# EAGLE schematic USER (EAGLE 9.3.0)
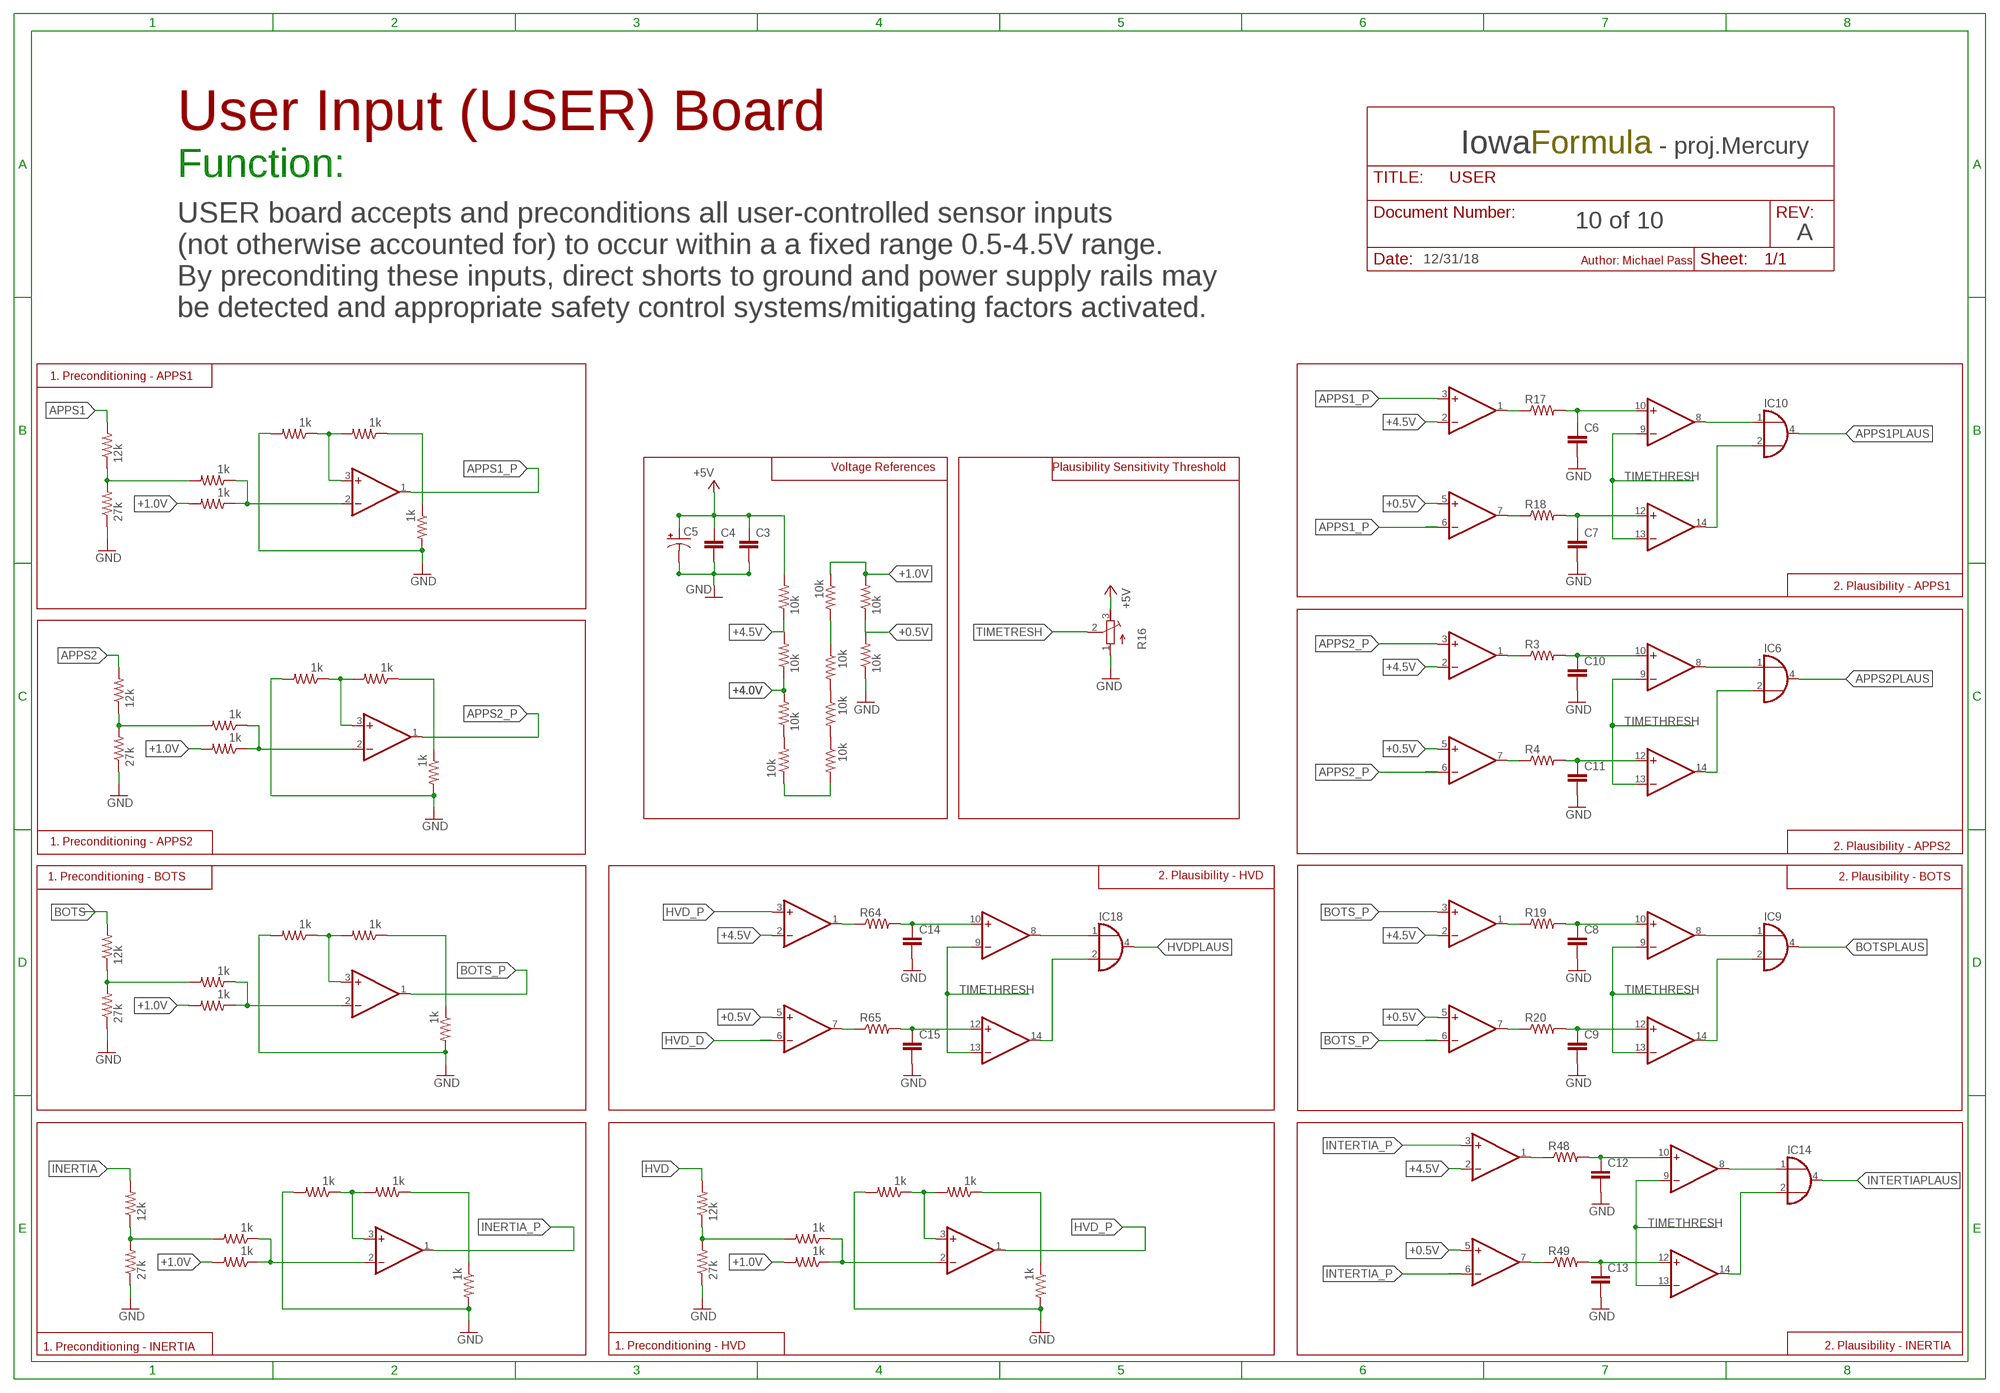
[diagram p0: schematic, sheet 1]

## Parts
C3  C-EUC0805  [C0805]
C4  C-EUC0805  [C0805]
C5  CPOL-US085CS-1AR  [085CS_1AR]
C6  C-EUC0805  [C0805]
C7  C-EUC0805  [C0805]
C8  C-EUC0805  [C0805]
C9  C-EUC0805  [C0805]
C10  C-EUC0805  [C0805]
C11  C-EUC0805  [C0805]
C12  C-EUC0805  [C0805]
C13  C-EUC0805  [C0805]
C14  C-EUC0805  [C0805]
C15  C-EUC0805  [C0805]
IC1  OP11D  [SO14]
IC3  OP11D  [SO14]
IC4  OP11D  [SO14]
IC5  OP11D  [SO14]
IC6  74AHC1G32DCK  [SC70-5]
IC7  OP11D  [SO14]
IC8  OP11D  [SO14]
IC9  74AHC1G32DCK  [SC70-5]
IC10  74AHC1G32DCK  [SC70-5]
IC13  OP11D  [SO14]
IC14  74AHC1G32DCK  [SC70-5]
IC17  OP11D  [SO14]
IC18  74AHC1G32DCK  [SC70-5]
IC19  OP11D  [SO14]
IC20  OP11D  [SO14]
R1  12k  R-US_R0805  [R0805]
R2  27k  R-US_R0805  [R0805]
R3  R-US_R0805  [R0805]
R4  R-US_R0805  [R0805]
R5  10k  R-US_R0805  [R0805]
R6  10k  R-US_R0805  [R0805]
R7  12k  R-US_R0805  [R0805]
R8  10k  R-US_R0805  [R0805]
R9  10k  R-US_R0805  [R0805]
R10  10k  R-US_R0805  [R0805]
R11  10k  R-US_R0805  [R0805]
R12  10k  R-US_R0805  [R0805]
R13  10k  R-US_R0805  [R0805]
R14  10k  R-US_R0805  [R0805]
R15  10k  R-US_R0805  [R0805]
R16  R-TRIMM3224X  [RTRIM3224X]
R17  R-US_R0805  [R0805]
R18  R-US_R0805  [R0805]
R19  R-US_R0805  [R0805]
R20  R-US_R0805  [R0805]
R21  27k  R-US_R0805  [R0805]
R22  1k  R-US_R0805  [R0805]
R23  1k  R-US_R0805  [R0805]
R24  1k  R-US_R0805  [R0805]
R25  1k  R-US_R0805  [R0805]
R26  1k  R-US_R0805  [R0805]
R48  R-US_R0805  [R0805]
R49  R-US_R0805  [R0805]
R64  R-US_R0805  [R0805]
R65  R-US_R0805  [R0805]
R66  1k  R-US_R0805  [R0805]
R67  1k  R-US_R0805  [R0805]
R68  1k  R-US_R0805  [R0805]
R69  1k  R-US_R0805  [R0805]
R70  1k  R-US_R0805  [R0805]
R71  12k  R-US_R0805  [R0805]
R72  27k  R-US_R0805  [R0805]
R73  1k  R-US_R0805  [R0805]
R74  1k  R-US_R0805  [R0805]
R75  1k  R-US_R0805  [R0805]
R76  1k  R-US_R0805  [R0805]
R77  1k  R-US_R0805  [R0805]
R78  12k  R-US_R0805  [R0805]
R79  27k  R-US_R0805  [R0805]
R80  1k  R-US_R0805  [R0805]
R81  1k  R-US_R0805  [R0805]
R82  1k  R-US_R0805  [R0805]
R83  1k  R-US_R0805  [R0805]
R84  1k  R-US_R0805  [R0805]
R85  12k  R-US_R0805  [R0805]
R86  27k  R-US_R0805  [R0805]
R87  1k  R-US_R0805  [R0805]
R88  1k  R-US_R0805  [R0805]
R89  1k  R-US_R0805  [R0805]
R90  1k  R-US_R0805  [R0805]
R91  1k  R-US_R0805  [R0805]

## Nets
+0.5V: IC1.5(B:+IN) IC4.5(B:+IN) IC5.5(B:+IN) IC13.5(B:+IN) IC17.5(B:+IN) R14.1 R15.2
+1.0V: R13.1 R14.2 R23.2 R67.2 R74.2 R81.2 R88.2
+4.0V: R6.1 R8.2
+4.5V: IC1.2(A:-IN) IC4.2(A:-IN) IC5.2(A:-IN) IC13.2(A:-IN) IC17.2(A:-IN) R5.1 R6.2
+5V: C3.1 C4.1 C5.+ R5.2 R16.3(E)
APPS1: R71.2
APPS1_P: IC5.3(A:+IN) IC5.6(B:-IN) IC7.1(A:OUT)
APPS1PLAUS: IC10.4(O)
APPS2: R78.2
APPS2_P: IC1.3(A:+IN) IC1.6(B:-IN) IC19.1(A:OUT)
APPS2PLAUS: IC6.4(O)
BOTS: R7.2
BOTS_P: IC4.3(A:+IN) IC4.6(B:-IN) IC8.1(A:OUT)
BOTSPLAUS: IC9.4(O)
GND: C3.2 C4.2 C5.- C6.2 C7.2 C8.2 C9.2 C10.2 C11.2 C12.2 C13.2 C14.2 C15.2 R2.1 R15.1 R16.1(A) R21.1 R24.2 R26.2 R68.2 R70.2 R72.1 R75.2 R77.2 R79.1 R82.2 R84.2 R86.1 R89.2 R91.2
HVD: R85.2
HVD_D: IC17.6(B:-IN)
HVD_P: IC17.3(A:+IN) IC20.1(A:OUT)
HVDPLAUS: IC18.4(O)
INERTIA: R1.2
INERTIA_P: IC3.1(A:OUT)
INTERTIA_P: IC13.3(A:+IN) IC13.6(B:-IN)
INTERTIAPLAUS: IC14.4(O)
N$1: IC3.3(A:+IN) R68.1 R69.2
N$2: R8.1 R9.2
N$3: IC4.1(A:OUT) R19.1
N$4: R9.1 R10.2
N$5: R11.1 R12.2
N$6: IC5.1(A:OUT) R17.1
N$7: R12.1 R13.2
N$8: R1.1 R2.2 R66.2
N$9: R10.1 R11.2
N$10: R69.1 R70.1
N$11: IC3.2(A:-IN) R66.1 R67.1
N$12: C6.1 IC5.10(C:+IN) R17.2
N$13: C7.1 IC5.12(D:+IN) R18.2
N$14: IC5.7(B:OUT) R18.1
N$15: IC1.1(A:OUT) R3.1
N$16: C10.1 IC1.10(C:+IN) R3.2
N$17: C11.1 IC1.12(D:+IN) R4.2
N$18: IC1.7(B:OUT) R4.1
N$20: C8.1 IC4.10(C:+IN) R19.2
N$23: C9.1 IC4.12(D:+IN) R20.2
N$24: IC4.7(B:OUT) R20.1
N$26: IC1.8(C:OUT) IC6.1(I0)
N$27: IC1.14(D:OUT) IC6.2(I1)
N$28: IC8.3(A:+IN) R24.1 R25.2
N$29: R7.1 R21.2 R22.2
N$30: R25.1 R26.1
N$31: IC8.2(A:-IN) R22.1 R23.1
N$34: IC4.8(C:OUT) IC9.1(I0)
N$35: IC4.14(D:OUT) IC9.2(I1)
N$42: IC13.1(A:OUT) R48.1
N$43: C12.1 IC13.10(C:+IN) R48.2
N$44: IC7.3(A:+IN) R75.1 R76.2
N$45: R71.1 R72.2 R73.2
N$46: IC5.8(C:OUT) IC10.1(I0)
N$47: IC5.14(D:OUT) IC10.2(I1)
N$48: C13.1 IC13.12(D:+IN) R49.2
N$49: IC13.7(B:OUT) R49.1
N$50: IC13.8(C:OUT) IC14.1(I0)
N$51: IC13.14(D:OUT) IC14.2(I1)
N$60: IC17.1(A:OUT) R64.1
N$61: C14.1 IC17.10(C:+IN) R64.2
N$62: C15.1 IC17.12(D:+IN) R65.2
N$63: IC17.7(B:OUT) R65.1
N$64: IC17.8(C:OUT) IC18.1(I0)
N$65: IC17.14(D:OUT) IC18.2(I1)
N$66: R76.1 R77.1
N$67: IC7.2(A:-IN) R73.1 R74.1
N$68: IC19.3(A:+IN) R82.1 R83.2
N$69: R78.1 R79.2 R80.2
N$70: R83.1 R84.1
N$71: IC19.2(A:-IN) R80.1 R81.1
N$72: IC20.3(A:+IN) R89.1 R90.2
N$73: R85.1 R86.2 R87.2
N$74: R90.1 R91.1
N$75: IC20.2(A:-IN) R87.1 R88.1
TIMETHRESH: IC1.9(C:-IN) IC1.13(D:-IN) IC4.9(C:-IN) IC4.13(D:-IN) IC5.9(C:-IN) IC5.13(D:-IN) IC13.9(C:-IN) IC13.13(D:-IN) IC17.9(C:-IN) IC17.13(D:-IN)
TIMETRESH: R16.2(S)
Unconnected: IC3.5(B:+IN) IC3.6(B:-IN) IC3.7(B:OUT) IC3.8(C:OUT) IC3.9(C:-IN) IC3.10(C:+IN) IC3.12(D:+IN) IC3.13(D:-IN) IC3.14(D:OUT) IC7.5(B:+IN) IC7.6(B:-IN) IC7.7(B:OUT) IC7.8(C:OUT) IC7.9(C:-IN) IC7.10(C:+IN) IC7.12(D:+IN) IC7.13(D:-IN) IC7.14(D:OUT) IC8.5(B:+IN) IC8.6(B:-IN) IC8.7(B:OUT) IC8.8(C:OUT) IC8.9(C:-IN) IC8.10(C:+IN) IC8.12(D:+IN) IC8.13(D:-IN) IC8.14(D:OUT) IC19.5(B:+IN) IC19.6(B:-IN) IC19.7(B:OUT) IC19.8(C:OUT) IC19.9(C:-IN) IC19.10(C:+IN) IC19.12(D:+IN) IC19.13(D:-IN) IC19.14(D:OUT) IC20.5(B:+IN) IC20.6(B:-IN) IC20.7(B:OUT) IC20.8(C:OUT) IC20.9(C:-IN) IC20.10(C:+IN) IC20.12(D:+IN) IC20.13(D:-IN) IC20.14(D:OUT)

## Notes on the sheet
- User Input (USER) Board
- Iowa | Formula | - proj.Mercury
- Function:
- 10 of 10
- A
- 12/31/18 | Author: Michael Pass
- USER board accepts and preconditions all user-controlled sensor inputs
  (not otherwise accounted for) to occur within a a fixed range 0.5-4.5V range.
  By preconditing these inputs, direct shorts to ground and power supply rails may
  be detected and appropriate safety control systems/mitigating factors activated.
- 1. Preconditioning - APPS1
- Voltage References | Plausibility Sensitivity Threshold
- 2. Plausibility - APPS1
- 1. Preconditioning - APPS2
- 2. Plausibility - APPS2
- 1. Preconditioning - BOTS | 2. Plausibility - HVD | 2. Plausibility - BOTS
- 1. Preconditioning - INERTIA | 1. Preconditioning - HVD | 2. Plausibility - INERTIA

## Power pins joined to a net without a drawn wire
GND: IC6.3(GND) IC9.3(GND) IC10.3(GND) IC14.3(GND) IC18.3(GND)
V+: IC1.4(P:V+) IC3.4(P:V+) IC4.4(P:V+) IC5.4(P:V+) IC7.4(P:V+) IC8.4(P:V+) IC13.4(P:V+) IC17.4(P:V+) IC19.4(P:V+) IC20.4(P:V+)
V-: IC1.11(P:V-) IC3.11(P:V-) IC4.11(P:V-) IC5.11(P:V-) IC7.11(P:V-) IC8.11(P:V-) IC13.11(P:V-) IC17.11(P:V-) IC19.11(P:V-) IC20.11(P:V-)
VCC: IC6.5(VCC) IC9.5(VCC) IC10.5(VCC) IC14.5(VCC) IC18.5(VCC)

## Library data of the parts
C3 C4 C6-C15 = rcl:C-EU: CAPACITOR, European symbol; SPICEPREFIX: C
C5 = rcl:CPOL-US: POLARIZED CAPACITOR, American symbol; SPICEPREFIX: C
IC1 IC3-IC5 IC7 IC8 IC13 IC17 IC19 IC20 = linear:OP11: Quad Low-Offset Low-Power OP AMP The OP-11 is pin compatible with the OP-400 , LM148, HA4741, RM4156, and LT1014 operational amplifiers source http://products.analog.com/products/info.asp?product=OP400
IC6 IC9 IC10 IC14 IC18 = 74xx-little-de:74*1G32: 2-input OR gate
R1-R15 R17-R26 R48 R49 R64-R91 = rcl:R-US_: RESISTOR, American symbol; SPICEPREFIX: R
R16 = rcl:R-TRIMM: Trimm resistor; SPICEMODEL: X; SPICEPREFIXL: POT